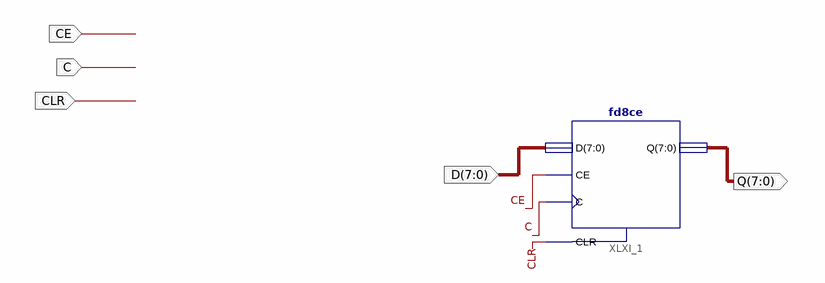
[diagram p0: schematic sheet 1]
// Xilinx ISE schematic SandBox.sch (spartan3e) as structural Verilog: 1 symbols, 5 ports
module SandBox (
  input  [7:0] D,
  input  C,
  input  CE,
  input  CLR,
  output [7:0] Q
);

  fd8ce XLXI_1 (.C(C), .CE(CE), .CLR(CLR), .D(D), .Q(Q));
endmodule
